# Altium schematic sheet SERIALIO.SCHDOC
size B
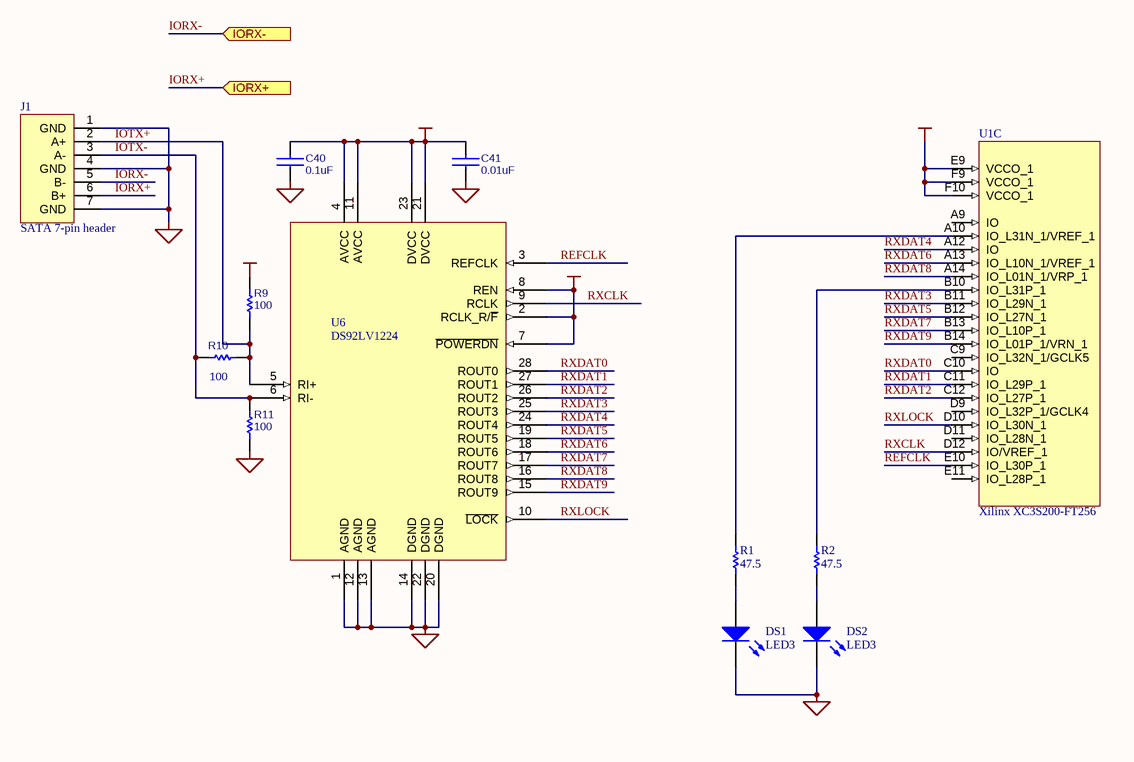
[diagram p0: SERIALIO.SCHDOC]

## Parts
C40  value 0.1uF  [0603]  (hidden comment: CAPACITOR)
C41  value 0.01uF  [0402]  (hidden comment: CAPACITOR)
DS1  LED3  [SMD _LED]
DS2  LED3  [SMD _LED]
J1  SATA 7-pin header  [MOLES 67800-5005]
R1  value 47.5  [0603]  (hidden comment: current-limiting series res)
R2  value 47.5  [0603]  (hidden comment: current-limiting series res)
R9  100  [0603]
R10  100  [0603]
R11  100  [0603]
U1  Xilinx XC3S200-FT256  [Xilinx FT256 BGA]  (part C of 9)
U6  DS92LV1224  [SSO-G28/E4.3]

## Ports
IORX+ (in), IORX- (in)

## Nets
GND: C40.1 C41.1 DS1.2(K) DS2.2(K) J1.1(GND) J1.4(GND) J1.7(GND) R11.1 U6.1(AGND) U6.12(AGND) U6.13(AGND) U6.14(DGND) U6.20(DGND) U6.22(DGND)
VCC: C40.2 C41.2 R9.1 U1.E9(VCCO_1) U1.F9(VCCO_1) U1.F10(VCCO_1) U6.2(RCLK_R/~{F}) U6.4(AVCC) U6.7(~{POWERDN}) U6.8(REN) U6.11(AVCC) U6.21(DVCC) U6.23(DVCC)
IORX+: J1.6(B+) ; port IORX+
IORX-: J1.5(B-) ; port IORX-
IOTX+: J1.2(A+) R9.2 R10.2 U6.5(RI+)
IOTX-: J1.3(A-) R10.1 R11.2 U6.6(RI-)
REFCLK: U1.E10(IO_L30P_1) U6.3(REFCLK)
RXCLK: U1.D12(IO/VREF_1) U6.9(RCLK)
RXDAT0: U1.C10(IO) U6.28(ROUT0)
RXDAT1: U1.C11(IO_L29P_1) U6.27(ROUT1)
RXDAT2: U1.C12(IO_L27P_1) U6.26(ROUT2)
RXDAT3: U1.B11(IO_L29N_1) U6.25(ROUT3)
RXDAT4: U1.A12(IO) U6.24(ROUT4)
RXDAT5: U1.B12(IO_L27N_1) U6.19(ROUT5)
RXDAT6: U1.A13(IO_L10N_1/VREF_1) U6.18(ROUT6)
RXDAT7: U1.B13(IO_L10P_1) U6.17(ROUT7)
RXDAT8: U1.A14(IO_L01N_1/VRP_1) U6.16(ROUT8)
RXDAT9: U1.B14(IO_L01P_1/VRN_1) U6.15(ROUT9)
RXLOCK: U1.D10(IO_L30N_1) U6.10(~{LOCK})
NetDS1_1: DS1.1(A) R1.2
NetDS2_1: DS2.1(A) R2.2
NetR1_1: R1.1 U1.A10(IO_L31N_1/VREF_1)
NetR2_1: R2.1 U1.B10(IO_L31P_1)

Not connected (* = marked no-connect by the designer): U1 A9(IO) C9(IO_L32N_1/GCLK5) D9(IO_L32P_1/GCLK4) D11(IO_L28N_1) E11(IO_L28P_1)

## Notes on the sheet
- Title:
- Engineer:
- Date:
- Revision:
- Sheet
- of
- File:

## Library data of the parts
C40 C41 = CAPACITOR: Standard Capacitor
DS1 DS2 = LED3: Typical BLUE SiC LED; Published: 8-Jun-2000; LatestRevisionDate: 17-Dec-2003; LatestRevisionNote: PCB Footprint replaced.; Publisher: Altium Limited
J1 = SATA-7
R1 R2 R10 = RESISTOR: Standard Passive Resistor
  R10: Value: 100
R9 R11 = RESISTOR: Standard Passive Resistor; Value: TERMVALUE
U1 = XC3S200-FT256: Xilinx Spartan-3 FPGA
U6 = DS92LV1224: 30-66 MHz 10-Bit Bus LVDS Deserializer